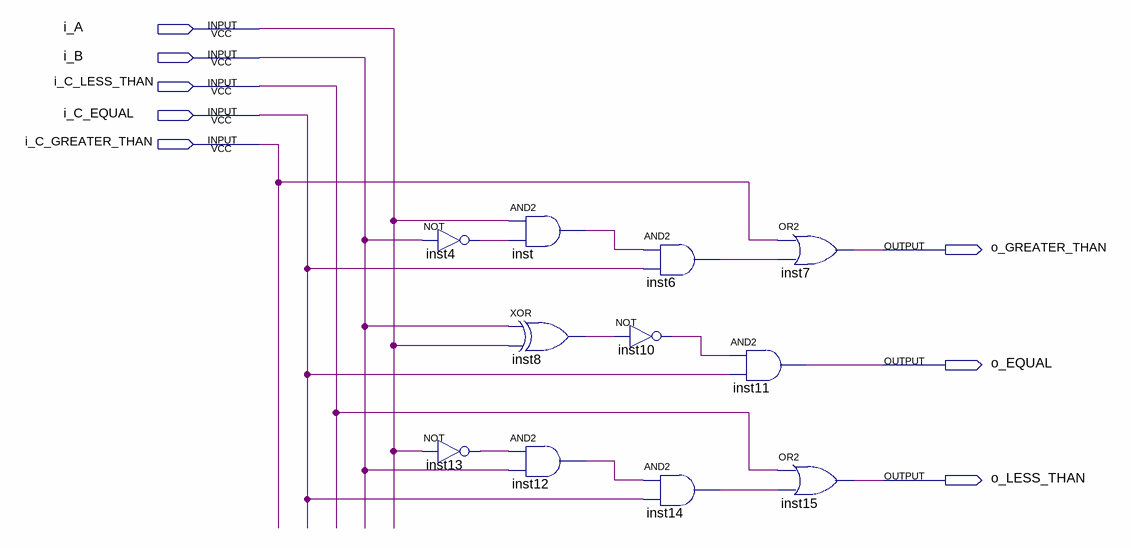
[diagram p0: schematic sheet]
// Quartus schematic comparator_1b.bdf as structural Verilog: 11 symbols, 8 pins
module comparator_1b (
  input  i_A,
  input  i_B,
  input  i_C_LESS_THAN,
  input  i_C_EQUAL,
  input  i_C_GREATER_THAN,
  output o_GREATER_THAN,
  output o_EQUAL,
  output o_LESS_THAN
);

  wire inst4_out, inst6_out, inst8_out, inst10_out, inst12_out, inst13_out, inst14_out, inst_out;

  not inst4 (inst4_out, i_B);
  not inst13 (inst13_out, i_A);
  and inst (inst_out, i_A, inst4_out);
  xor inst8 (inst8_out, i_B, i_A);
  and inst12 (inst12_out, inst13_out, i_B);
  not inst10 (inst10_out, inst8_out);
  and inst6 (inst6_out, inst_out, i_C_EQUAL);
  and inst14 (inst14_out, inst12_out, i_C_EQUAL);
  or inst7 (o_GREATER_THAN, i_C_GREATER_THAN, inst6_out);
  and inst11 (o_EQUAL, inst10_out, i_C_EQUAL);
  or inst15 (o_LESS_THAN, i_C_LESS_THAN, inst14_out);
endmodule
